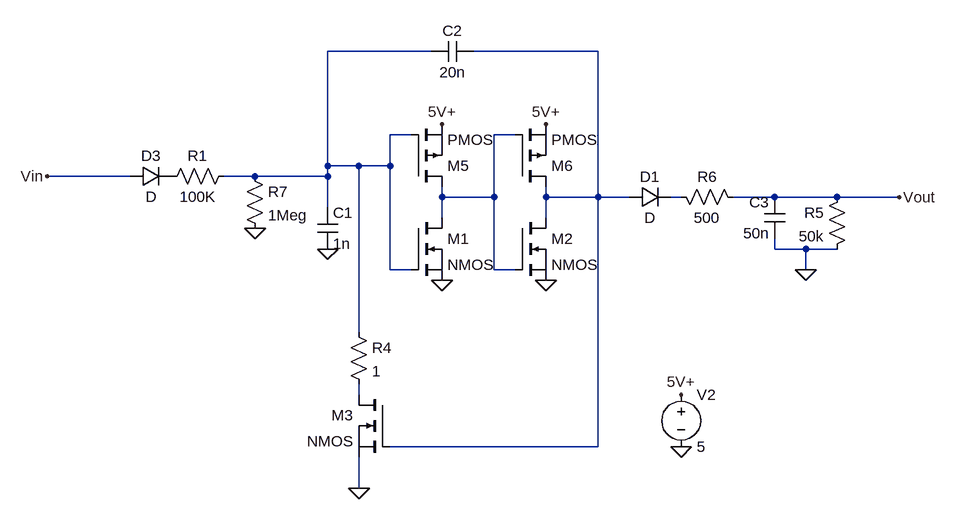
[diagram p0: schematic AHP.asc]
AHP.asc, the LTspice schematic file:
Version 4
SHEET 1 1244 680
WIRE 384 -144 224 -144
WIRE 640 -144 448 -144
WIRE 352 -16 320 -16
WIRE 512 -16 480 -16
WIRE 224 32 224 -144
WIRE 272 32 224 32
WIRE 320 32 320 -16
WIRE 320 32 272 32
WIRE -80 48 -208 48
WIRE 112 48 64 48
WIRE 224 48 224 32
WIRE 224 48 112 48
WIRE 400 80 400 64
WIRE 480 80 480 -16
WIRE 480 80 400 80
WIRE 560 80 560 64
WIRE 640 80 640 -144
WIRE 640 80 560 80
WIRE 688 80 640 80
WIRE 768 80 752 80
WIRE 912 80 848 80
WIRE 1008 80 912 80
WIRE 1104 80 1008 80
WIRE 224 96 224 48
WIRE 400 112 400 80
WIRE 560 112 560 80
WIRE 912 160 912 144
WIRE 960 160 912 160
WIRE 1008 160 960 160
WIRE 320 192 320 32
WIRE 352 192 320 192
WIRE 480 192 480 80
WIRE 512 192 480 192
WIRE 960 192 960 160
WIRE 272 288 272 32
WIRE 272 384 272 368
WIRE 640 464 640 80
WIRE 640 464 320 464
WIRE 272 528 272 480
FLAG 768 464 0
FLAG 768 384 5V+
FLAG 224 160 0
FLAG 400 -32 5V+
FLAG 560 -32 5V+
FLAG 560 208 0
FLAG 400 208 0
FLAG 272 528 0
FLAG -208 48 Vin
FLAG 1104 80 Vout
FLAG 960 192 0
FLAG 112 128 0
SYMBOL res 80 32 R90
WINDOW 0 0 56 VBottom 2
WINDOW 3 32 56 VTop 2
SYMATTR InstName R1
SYMATTR Value 100K
SYMBOL cap 208 96 R0
SYMATTR InstName C1
SYMATTR Value 1n
SYMBOL cap 448 -160 R90
WINDOW 0 0 32 VBottom 2
WINDOW 3 32 32 VTop 2
SYMATTR InstName C2
SYMATTR Value 20n
SYMBOL voltage 768 368 R0
WINDOW 123 0 0 Left 2
WINDOW 39 0 0 Left 2
SYMATTR InstName V2
SYMATTR Value 5
SYMBOL nmos 320 384 M0
SYMATTR InstName M3
SYMBOL nmos 352 112 R0
SYMATTR InstName M1
SYMBOL nmos 512 112 R0
SYMATTR InstName M2
SYMBOL pmos 352 64 M180
SYMATTR InstName M5
SYMBOL pmos 512 64 M180
SYMATTR InstName M6
SYMBOL diode -80 64 R270
WINDOW 0 32 32 VTop 2
WINDOW 3 0 32 VBottom 2
SYMATTR InstName D3
SYMBOL res 256 272 R0
SYMATTR InstName R4
SYMATTR Value 1
SYMBOL res 1024 64 M0
SYMATTR InstName R5
SYMATTR Value 50k
SYMBOL cap 928 80 M0
SYMATTR InstName C3
SYMATTR Value 50n
SYMBOL res 752 64 M90
WINDOW 0 0 56 VBottom 2
WINDOW 3 32 56 VTop 2
SYMATTR InstName R6
SYMATTR Value 500
SYMBOL diode 688 96 R270
WINDOW 0 32 32 VTop 2
WINDOW 3 0 32 VBottom 2
SYMATTR InstName D1
SYMBOL res 96 32 R0
SYMATTR InstName R7
SYMATTR Value 1Meg

The netlist it stands for:
* AHP.asc
R1 N001 P001 100K
C1 N001 0 1n
C2 N002 N001 20n
V2 5V+ 0 5
M3 N005 N002 0 0 NMOS
M1 N003 N001 0 0 NMOS
M2 N002 N003 0 0 NMOS
M5 N003 N001 5V+ 5V+ PMOS
M6 N002 N003 5V+ 5V+ PMOS
D3 Vin P001 D
R4 N001 N005 1
R5 Vout 0 50k
C3 Vout 0 50n
R6 N004 Vout 500
D1 N002 N004 D
R7 N001 0 1Meg
.model D D
.lib standard.dio
.model NMOS NMOS
.model PMOS PMOS
.lib standard.mos
.backanno
.end